# EasyEDA Pro project 25工创PCB.eprj, board 云台底部分线板PCB
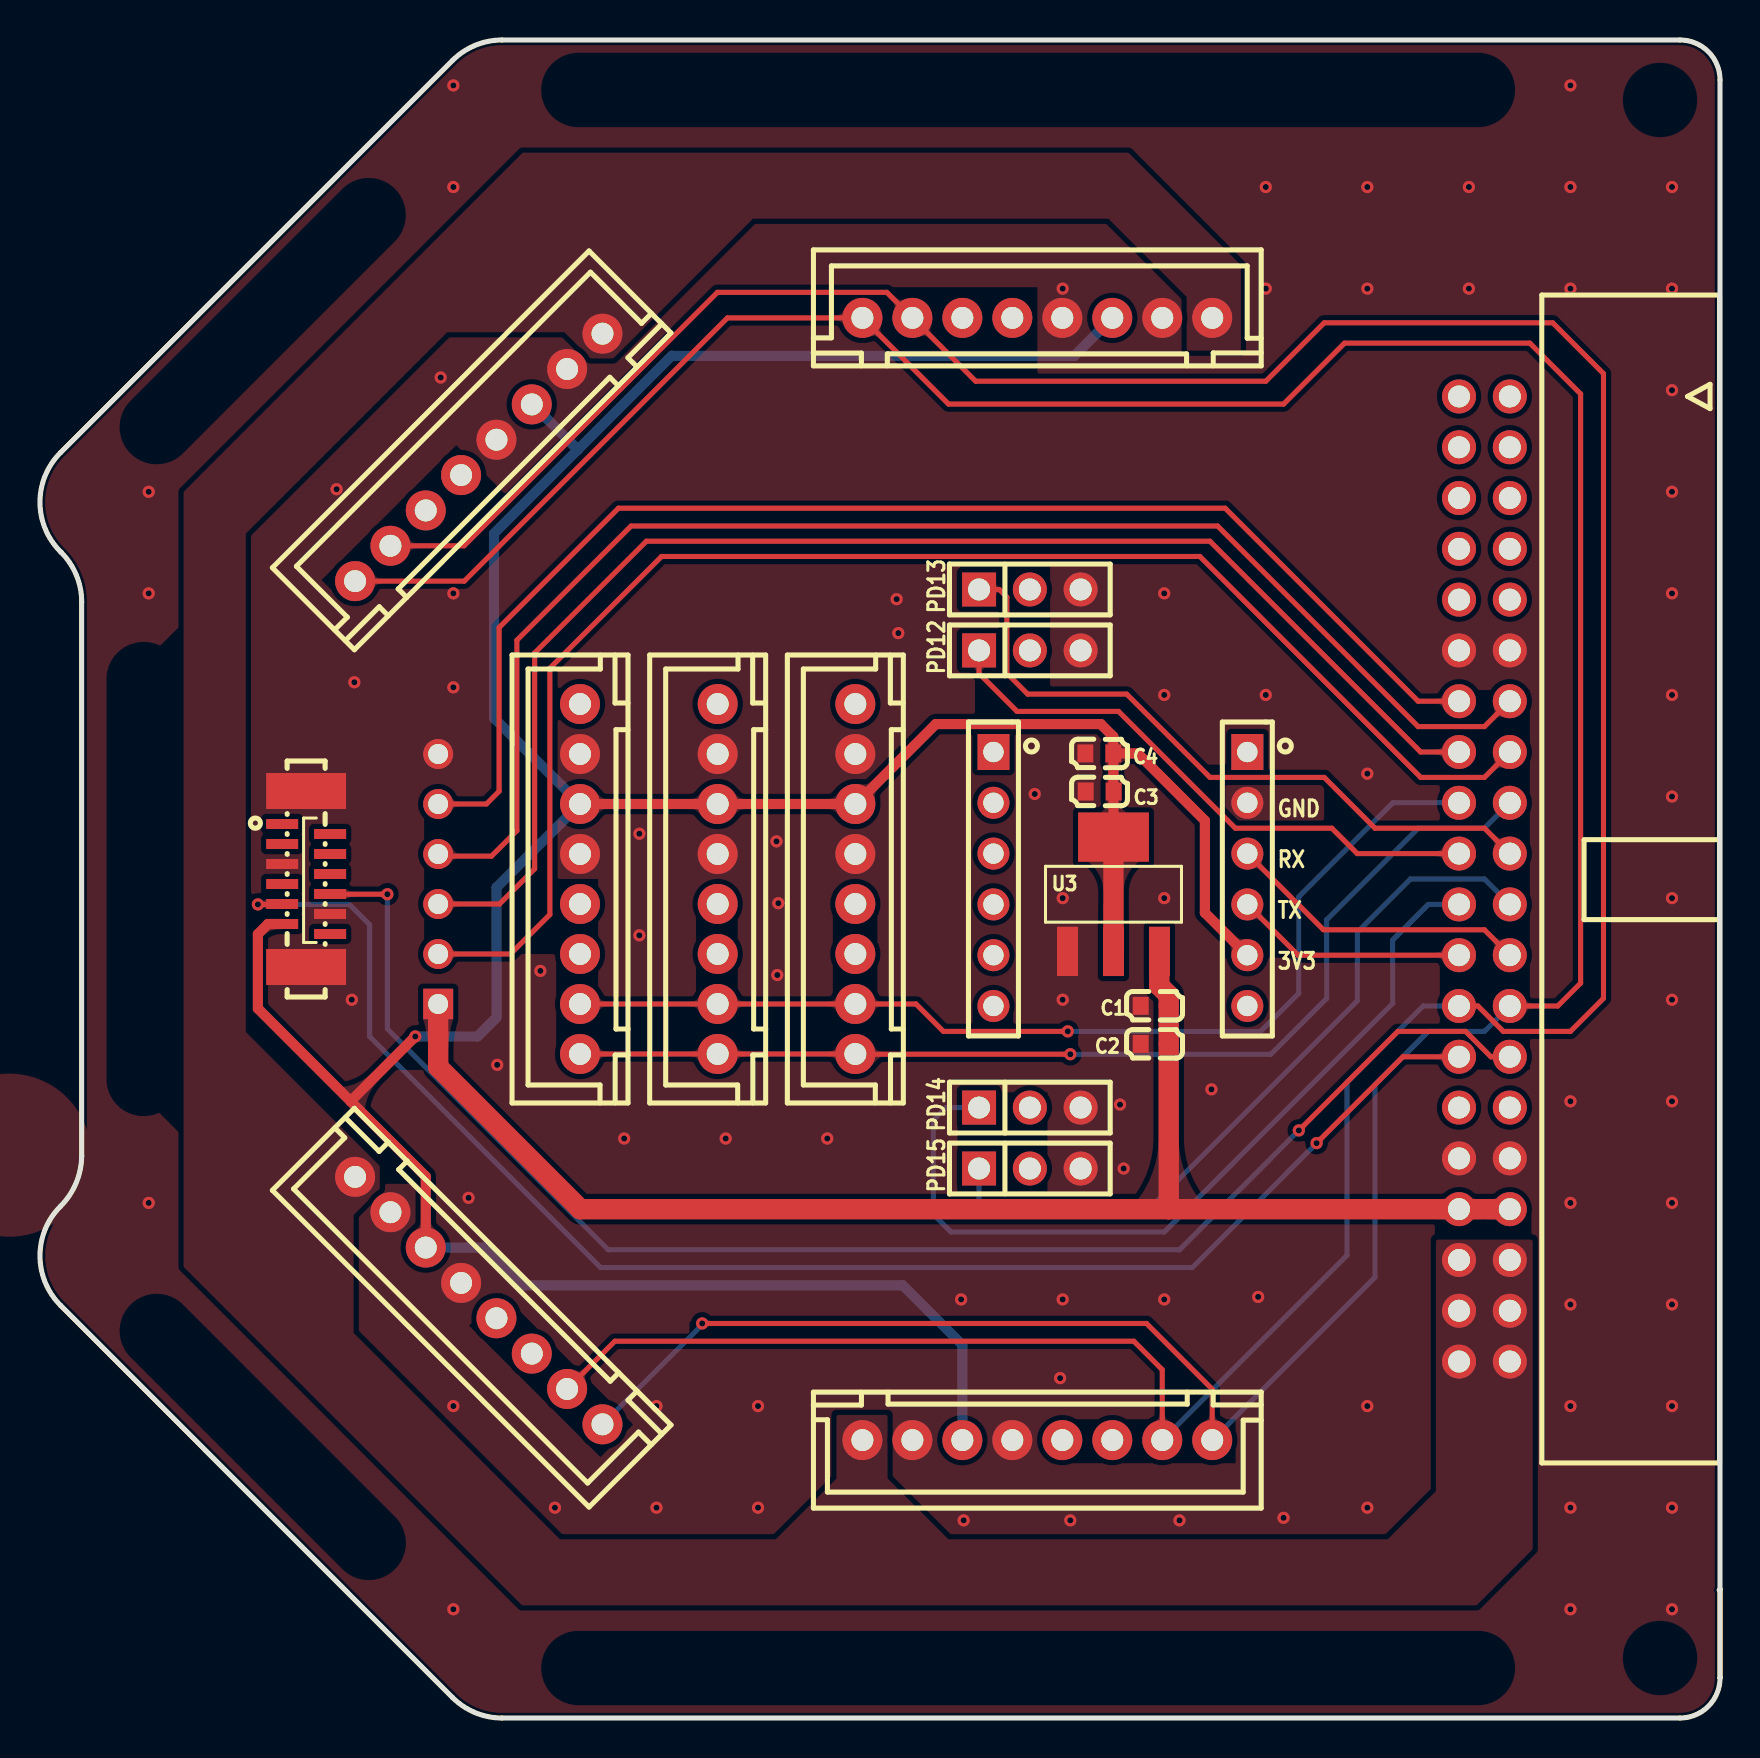
[diagram p12: board, top side]
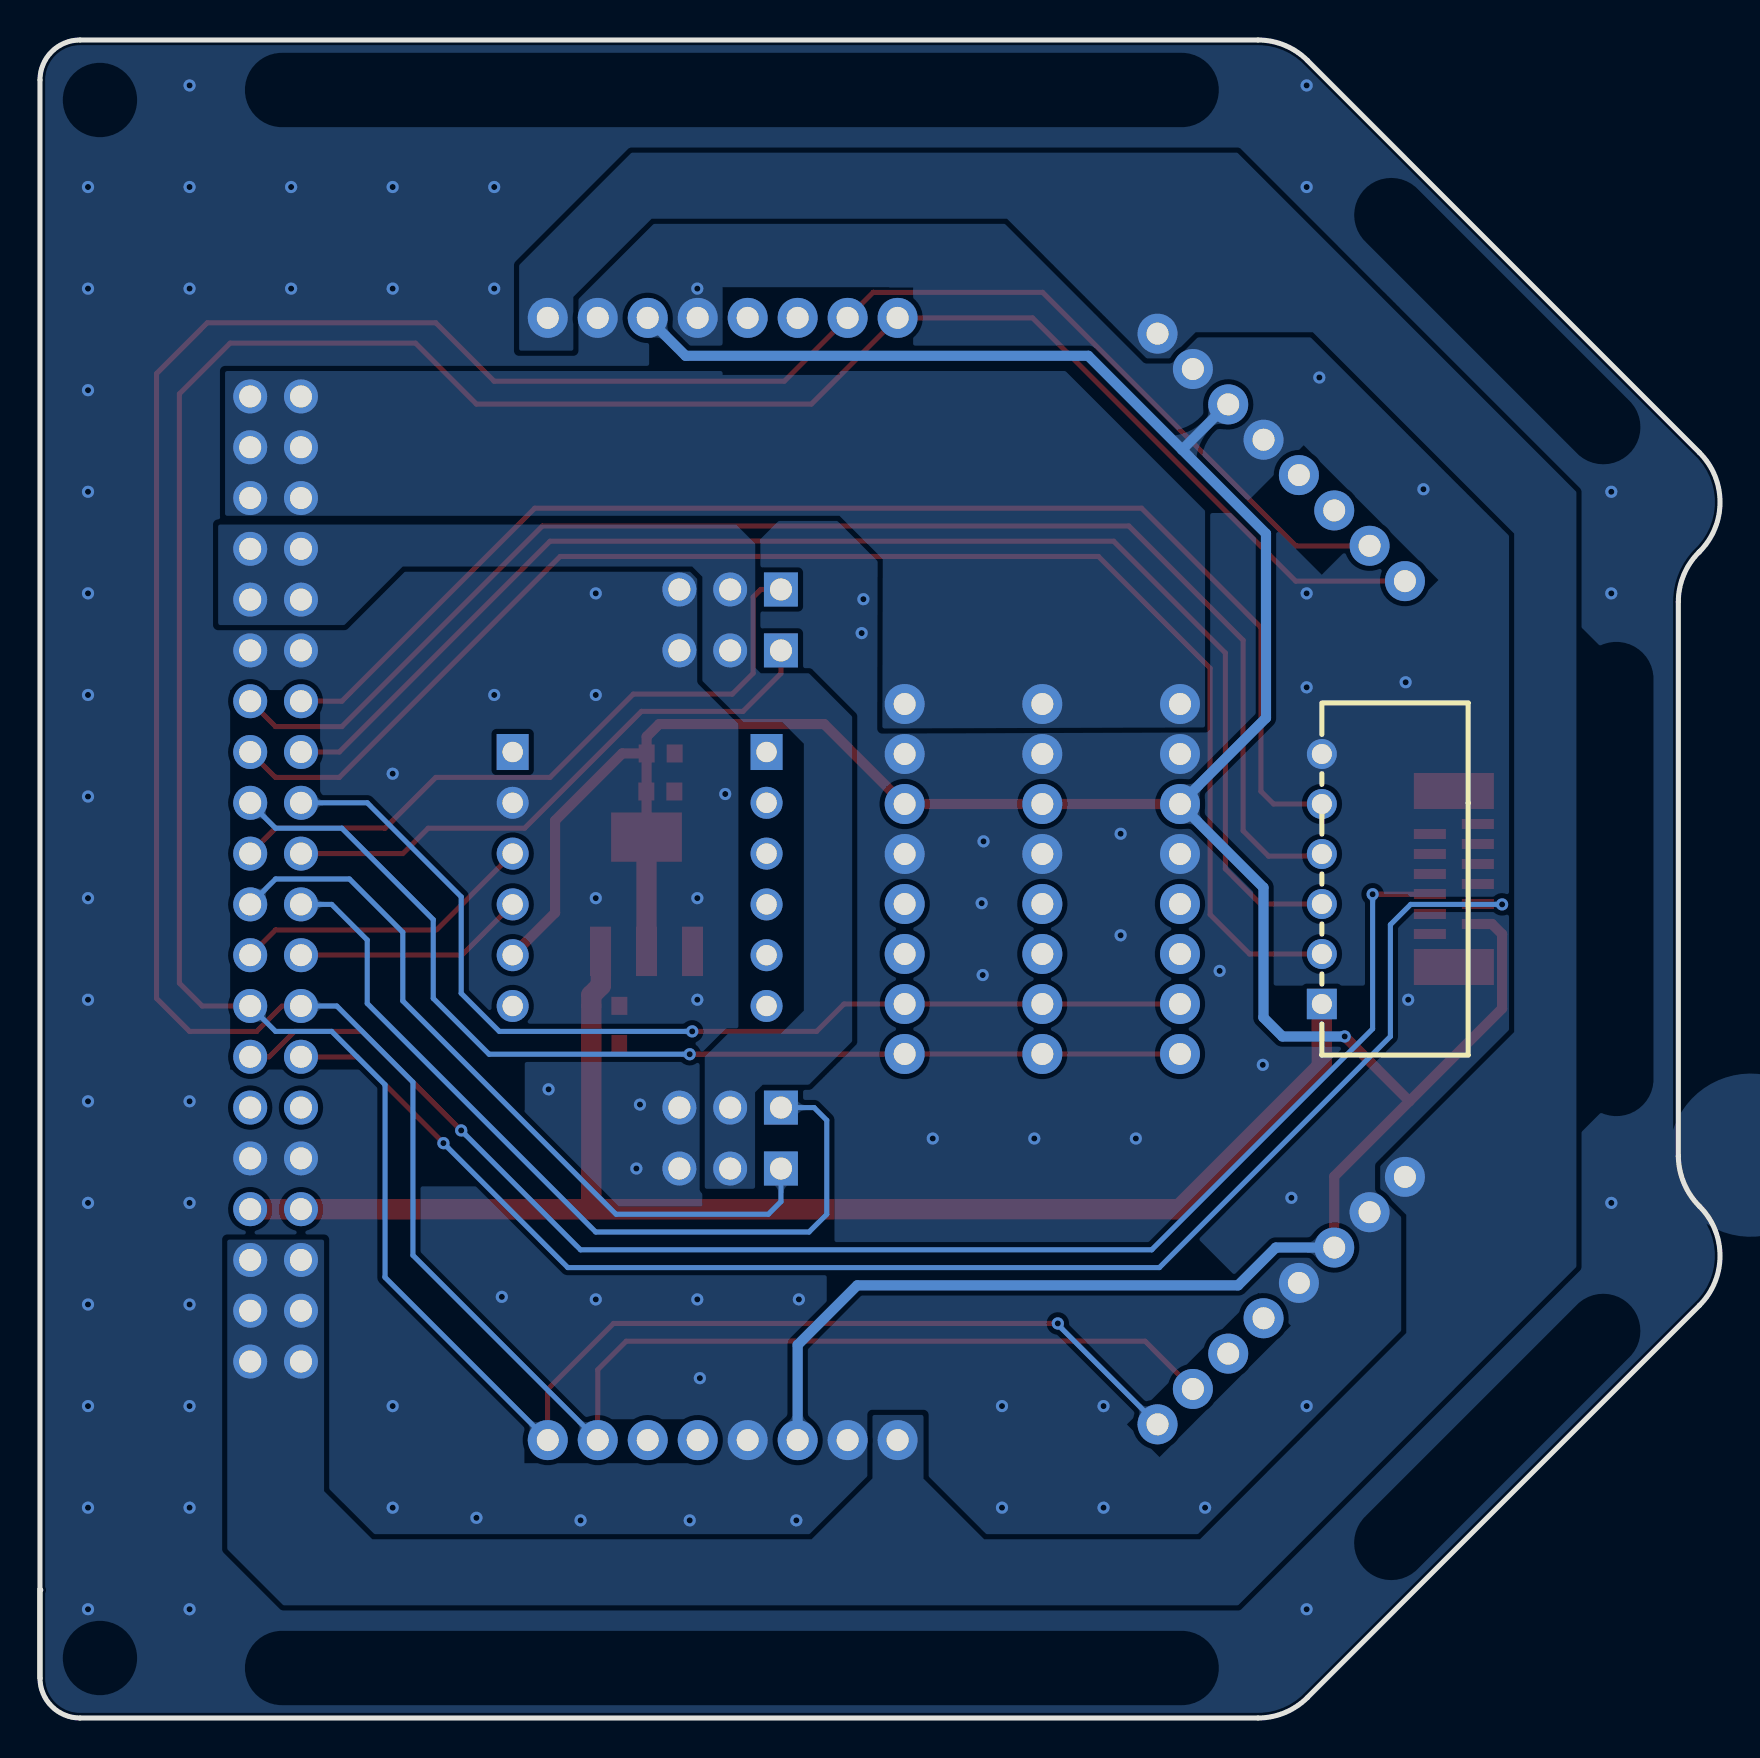
[diagram p13: board, bottom side, seen from below]

Outline 84.04 x 83.91 mm; copper layers: Top Layer, Bottom Layer. Coordinates in mm from the lower left corner of the outline.
Outline path: 1.03,25.59 arc(0,23.11) 1.03,20.64 20.64,1.03 arc(21.77,0.27) 23.11,0 82.04,0 arc(83.46,0.59) 84.04,2 ; 1.03,25.59 1.06,25.62 ; 1.03,25.59 arc(1.8,26.74) 2.09,28.1 2.09,55.81 arc(1.82,57.15) 1.06,58.29 1.03,58.32 arc(0,60.8) 1.03,63.27 20.64,82.89 arc(21.77,83.64) 23.11,83.91 82.04,83.91 arc(83.46,83.32) 84.04,81.91 84.04,2 ; 84.04,2 84.04,6.44 84,6.4
Stack: Top Layer 0.035mm / Dielectric1 1.51mm FR4 er 4.5 / Bottom Layer 0.035mm

## Design rules (mm)
template: 自定义配置
spacing copperThickness1oz (default): track to track 0.102, other pairs 0.152 to 0.3
spacing copperThickness2oz: track to track 0.203, other pairs 0.152 to 0.3
track width copperThickness1oz (default): min 0.127, default 0.254, max 2.54
track width copperThickness2oz: min 0.203, default 0.254, max 2.54
differential pair differentialPair (default): width min 0.127, default 0.254, max 2.54; gap min 0.152, default 0.152
via viaSize (default): diameter min 0.5, default 0.61, max 10; hole min 0.3, default 0.305, max 6.3

## Placement (name value [footprint] x y rotation side)
C1  100nF  [C0603]  55.76 35.61 0 top
C2  100nF  [C0603]  55.76 33.71 0 top
C3  100nF  [C0603]  53.01 46.33 0 top
C4  100nF  [C0603]  52.99 48.23 180 top
CN1  B-3000R40P-0110  [IDC-TH_40P-P2.54_300R-40P]  72.26 41.96 90 top
CN2  ZX-XH2.54-8PZZ  [CONN-TH_8P-P2.50-XH2.54-8P]  40.79 41.96 270 top
CN3  ZX-XH2.54-8PZZ  [CONN-TH_8P-P2.50-XH2.54-8P]  33.9 41.96 270 top
CN4  ZX-XH2.54-8PZZ  [CONN-TH_8P-P2.50-XH2.54-8P]  27.01 41.96 270 top
CN5  ZX-XH2.54-8PZZ  [CONN-TH_8P-P2.50-XH2.54-8P#2]  21.95 63.04 225 top
CN6  ZX-XH2.54-8PZZ  [CONN-TH_8P-P2.50-XH2.54-8P#2]  21.95 20.87 315 top
CN7  ZX-XH2.54-8PZZ  [CONN-TH_8P-P2.50-XH2.54-8P]  49.89 70.01 180 top
CN8  ZX-XH2.54-8PZZ  [CONN-TH_8P-P2.50-XH2.54-8P]  49.89 13.9 0 top
H1  -  [HDR-TH_3P-P2.54-V-M]  49.52 53.39 0 top
H2  -  [HDR-TH_3P-P2.54-V-M]  49.52 56.43 0 top
H3  -  [HDR-TH_3P-P2.54-V-M]  49.52 30.53 0 top
H4  -  [HDR-TH_3P-P2.54-V-M]  49.52 27.48 0 top
HWT1  PM2.54-1*6  [hdr-th_6p-p2.54-v-f]  60.4 41.96 270 top
U1  FPC-0.5AL-12PB  [FPC-SMD_12P-P0.50_XUNPU_FPC-0.5AL-12PB]  13.31 41.96 270 top
U2  ZX-XH2.54-6PWZ  [CONN-TH_6P-P2.50_ZX-XH2.54-6PWZ]  19.92 41.96 90 bottom
U3  AMS1117-3.3  [SOT-223_L6.5-W3.5-P2.30-LS7.0-BR]  53.7 41.19 270 top
U4  PM2.54-1*6  [hdr-th_6p-p2.54-v-f]  47.7 41.96 270 top

## Footprints (pads in the part's own frame, mm; a bottom-side part is the same pattern mirrored in y, then rotated)
C0603
  rect 0.8x0.9 smd: 1(-0.7,0) 2(0.7,0)
CONN-TH_6P-P2.50_ZX-XH2.54-6PWZ
  rect 1.524x1.5 hole 1: 1(-6.25,0)
  round 1.5 hole 1: 2(-3.75,0) 3(-1.25,0) 4(1.25,0) 5(3.75,0) 6(6.25,0)
CONN-TH_8P-P2.50-XH2.54-8P
  round 2 hole 1.1: 1(8.75,0) 2(6.25,0) 3(3.75,0) 4(1.25,0) 5(-1.25,0) 6(-3.75,0) 7(-6.25,0) 8(-8.75,0)
CONN-TH_8P-P2.50-XH2.54-8P#2
  round 2 hole 1.1: 1(8.75,0) 2(6.25,0) 3(3.75,0) 4(1.25,0) 5(-1.25,0) 6(-3.75,0) 7(-6.25,0) 8(-8.75,0)
FPC-SMD_12P-P0.50_XUNPU_FPC-0.5AL-12PB
  rect 0.5x1.6 smd: 1(-2.75,-1.2) 2(-2.25,1.2) 3(-1.75,-1.2) 4(-1.25,1.2) 5(-0.75,-1.2) 6(-0.25,1.2) 7(0.25,-1.2) 8(0.75,1.2) 9(1.25,-1.2) 10(1.75,1.2) 11(2.25,-1.2) 12(2.75,1.2)
  rect 1.8x4 smd: 13(4.4,0) 14(-4.4,0)
HDR-TH_3P-P2.54-V-M
  rect 1.7x1.7 hole 1.1: 1(-2.54,0)
  round 1.7 hole 1.1: 2(0,0) 3(2.54,0)
hdr-th_6p-p2.54-v-f
  rect 1.8x1.6 hole 1.02: 1(-6.35,0)
  round 1.6 hole 1.02: 2(-3.81,0) 3(-1.27,0) 4(1.27,0) 5(3.81,0) 6(6.35,0)
IDC-TH_40P-P2.54_300R-40P
  round 1.7 hole 1.1: 1(24.13,1.27) 2(24.13,-1.27) 3(21.59,1.27) 4(21.59,-1.27) 5(19.05,1.27) 6(19.05,-1.27) 7(16.51,1.27) 8(16.51,-1.27) 9(13.97,1.27) 10(13.97,-1.27) 11(11.43,1.27) 12(11.43,-1.27) 13(8.89,1.27) 14(8.89,-1.27) 15(6.35,1.27) 16(6.35,-1.27) 17(3.81,1.27) 18(3.81,-1.27) 19(1.27,1.27) 20(1.27,-1.27) 21(-1.27,1.27) 22(-1.27,-1.27) 23(-3.81,1.27) 24(-3.81,-1.27) 25(-6.35,1.27) 26(-6.35,-1.27) 27(-8.89,1.27) 28(-8.89,-1.27) 29(-11.43,1.27) 30(-11.43,-1.27) 31(-13.97,1.27) 32(-13.97,-1.27) 33(-16.51,1.27) 34(-16.51,-1.27) 35(-19.05,1.27) 36(-19.05,-1.27) 37(-21.59,1.27) 38(-21.59,-1.27) 39(-24.13,1.27) 40(-24.13,-1.27)
SOT-223_L6.5-W3.5-P2.30-LS7.0-BR
  rect 2.465x1.05 smd: 1(2.857,-2.3) 2(2.857,0) 3(2.857,2.3)
  rect 2.465x3.54 smd: 4(-2.857,0)

## Nets
As in the schematic.

Pads without a net: CN2 3 4; CN3 3 4; CN4 3 4; CN5 3 4; CN6 3 4; CN7 3 4; CN8 3 4; HWT1 1 6; U1 1 2 3 4 6 7 12; U4 1 2 3 4 5 6

## Via types
v1: diameter 0.61, hole 0.305, Top Layer to Bottom Layer, 92 vias

## Routing (per net, layer and track width the routed paths; a pad name or vN(x,y) marks a point on that pad's centre or on a via; arc(x,y) is an arc through that point)
+3V3: length 182.5
  Top Layer w0.508: C4.1 54.91,48.23 58.27,44.88 58.27,40.27 HWT1.5 ; C4.1 53.69,49.07 53.06,49.7 44.81,49.7 40.81,45.71 CN2.6 CN3.6 CN4.6 ; C4.1 53.69,46.34 53.7,46.34 U3.4 ; CN6.6 19.3,27.08 15.54,30.84 ; v1(18.77,34.08) 15.54,30.84 ; 15.54,30.84 10.9,35.48 10.9,39.2 11.41,39.71 U1.11
  Top Layer w1.016: U3.2 U3.4
  Bottom Layer w0.508: v1(18.77,34.08) 21.89,34.08 22.84,35.03 22.84,41.53 CN4.6 22.71,50.01 22.71,59.23 26.91,63.42 ; 26.91,63.42 24.64,65.69 CN5.6 ; 26.91,63.42 31.6,68.12 51.74,68.12 CN7.6 ; CN8.6 46.14,18.65 43.16,21.64 24.11,21.64 22.22,23.52 CN6.6
+5V: length 72.8
  Top Layer w1.016: 56.46,25.45 27.03,25.45 19.92,32.56 U2.1 ; 56.46,25.45 CN1.33 CN1.34 ; 56.46,25.45 C2.2 C1.2 56.46,36.15 55.99,36.62 55.99,38.32 U3.3
GND:
  vias: v1(5.44,61.32) v1(5.44,56.24) v1(5.44,25.76) v1(14.84,61.45) v1(15.6,35.92) v1(15.73,51.79) v1(20.04,67.03) v1(20.68,81.64) v1(20.68,76.56) v1(20.68,56.24) v1(20.68,51.54) v1(20.68,15.6) v1(20.68,5.44) v1(21.44,26.01) v1(22.87,32.66) v1(25.03,37.36) v1(25.76,10.52) v1(29.22,28.98) v1(29.98,44.22) v1(29.98,39.14) v1(30.84,15.6) v1(30.84,10.52) v1(34.3,28.98) v1(35.92,15.6) v1(35.92,10.52) v1(36.84,43.84) v1(36.93,40.74) v1(36.88,37.15) v1(39.38,28.98) v1(42.85,55.95) v1(42.94,54.25) v1(46.08,20.93) v1(46.21,9.88) v1(49.76,46.21) v1(51.03,17) v1(51.16,71.48) v1(51.16,41) v1(51.16,35.92) v1(51.16,20.93) v1(51.54,9.88) v1(54.03,30.68) v1(54.21,27.48) v1(56.24,56.24) v1(56.24,51.16) v1(56.24,41) v1(56.24,20.93) v1(57,9.88) v1(58.6,31.44) v1(60.94,21.06) v1(61.32,76.56) v1(61.32,71.48) v1(61.32,51.16) v1(62.21,10.01) v1(66.4,76.56) v1(66.4,71.48) v1(66.4,47.22) v1(66.4,15.6) v1(66.4,10.52) v1(71.48,76.56) v1(71.48,71.48) v1(76.56,81.64) v1(76.56,76.56) v1(76.56,71.48) v1(76.56,30.84) v1(76.56,25.76) v1(76.56,20.68) v1(76.56,15.6) v1(76.56,10.52) v1(76.56,5.44) v1(81.64,76.56) v1(81.64,71.48) v1(81.64,66.4) v1(81.64,61.32) v1(81.64,56.24) v1(81.64,51.16) v1(81.64,46.08) v1(81.64,41) v1(81.64,35.92) v1(81.64,30.84) v1(81.64,25.76) v1(81.64,20.68) v1(81.64,15.6) v1(81.64,10.52) v1(81.64,5.44)
PB12: length 66
  Top Layer w0.254: U2.5 22.33,45.71 22.97,46.34 22.97,54.53 28.93,60.5 59.29,60.5 68.94,50.85 CN1.13
PB13: length 70.8
  Top Layer w0.254: CN1.14 72.26,49.58 68.94,49.58 58.91,59.61 29.57,59.61 23.85,53.89 23.85,44.37 22.58,43.1 20.02,43.1 U2.4
PB14: length 69.3
  Top Layer w0.254: U2.3 22.99,40.71 24.74,42.46 24.74,53.26 30.33,58.85 58.53,58.85 69.07,48.31 CN1.15
PB15: length 74.2
  Top Layer w0.254: U2.2 23.53,38.21 25.51,40.18 25.51,52.5 31.09,58.08 58.02,58.08 69.07,47.04 72.26,47.04 CN1.16
SERVO_PWM1: length 28.9
  Top Layer w0.254: CN1.19 65.89,43.23 64.62,44.5 59.8,44.5 53.95,50.34 48.87,50.34 46.98,52.24 H1.1
SERVO_PWM2: length 34.3
  Top Layer w0.254: H2.1 47.98,56.43 48.37,56.05 48.37,52.24 49.41,51.2 54.36,51.2 58.53,47.04 64.24,47.04 66.78,44.5 72.26,44.5 CN1.20
SERVO_PWM3: length 42.6
  Bottom Layer w0.254: CN1.21 69.45,40.69 67.67,38.91 67.67,35.73 56.24,24.3 45.57,24.3 44.68,25.19 44.68,29.89 45.32,30.53 H3.1
SERVO_PWM4: length 37.9
  Bottom Layer w0.254: CN1.22 72.26,41.96 68.56,41.96 65.89,39.29 65.89,35.86 55.22,25.19 47.6,25.19 46.98,25.82 H4.1
UART4_RX: length 170.4
  Top Layer w0.254: CN1.26 75.92,35.61 77.07,36.75 77.07,66.21 74.53,68.75 65.26,68.75 62.21,65.7 45.45,65.7 CN7.1 34.39,70.01 21.22,56.85 15.76,56.85 ; v1(33.13,19.73) 55.35,19.73 58.64,16.44 CN8.1
  Bottom Layer w0.254: CN8.1 66.78,22.04 66.78,31.67 69.45,34.34 72.26,34.34 CN1.26 ; 28.14,14.69 33.13,19.67 v1(33.13,19.73)
UART4_TX: length 173.5
  Top Layer w0.254: CN5.2 21.21,58.62 33.89,71.29 42.36,71.29 CN7.2 46.81,66.85 61.32,66.85 64.24,69.77 75.67,69.77 78.21,67.23 78.21,35.99 76.56,34.34 73.2,34.34 71.93,35.61 CN1.25 ; CN8.2 56.14,17.42 54.72,18.84 28.76,18.84 CN6.2
  Bottom Layer w0.254: CN8.2 65.38,23.14 65.38,31.8 69.19,35.61 CN1.25
UART5_RX: length 75.4
  Top Layer w0.254: U1.8 14.53,41.19 v1(17.38,41.19) ; CN1.28 72.58,33.07 71.31,34.34 67.92,34.34 v1(62.97,29.38)
  Bottom Layer w0.254: v1(17.38,41.19) 17.38,34.46 28.43,23.41 57,23.41 v1(62.97,29.38)
UART5_TX: length 76.5
  Top Layer w0.254: v1(10.9,40.69) 12.09,40.69 U1.9 ; v1(63.86,28.75) 68.18,33.07 CN1.27
  Bottom Layer w0.254: v1(10.9,40.69) 15.47,40.69 16.49,39.67 16.49,34.08 28.05,22.52 57.64,22.52 v1(63.86,28.75)
USART3_RX: length 54
  Top Layer w0.254: v1(51.54,33.19) 40.8,33.19 CN2.1 CN3.1 CN4.1
  Bottom Layer w0.254: CN1.18 72.26,44.5 68.94,44.5 64.37,39.92 64.37,35.99 61.57,33.19 v1(51.54,33.19)
USART3_TX: length 52.1
  Top Layer w0.254: CN4.2 CN3.2 CN2.2 43.82,35.71 45.19,34.34 v1(51.41,34.34)
  Bottom Layer w0.254: v1(51.41,34.34) 61.07,34.34 62.97,36.24 62.97,41.07 67.67,45.77 CN1.17
USART6_RX: length 15.2
  Top Layer w0.254: HWT1.3 64.21,39.42 72.26,39.42 CN1.24
USART6_TX: length 11.6
  Top Layer w0.254: HWT1.4 62.94,38.15 CN1.23

## Copper pours and planes (outline as drawn; the poured copper is in the pictures)
24V_1 on Top Layer: 15.69,25.16 15.69,19.26 26.01,8.94 36.81,8.94 39.85,11.97 39.85,15.16 42.4,15.16 42.4,11.98 45.44,8.94 67.42,8.94 69.83,11.35 69.83,23.92 74.67,23.92 74.67,8.45 71.86,5.63 24.11,5.63 7.18,22.56 7.18,61.32 24.14,78.28 54.45,78.28 60.07,72.65 60.07,68.38 57.36,68.38 57.36,71.06 53.45,74.98 35.67,74.98 28.68,67.99 27.54,67.99 26.23,69.29 20.37,69.29 10.3,59.23 10.3,34.3 17,27.6 17,26.46
24V_1 on Bottom Layer: 15.69,25.16 15.69,19.26 26.01,8.94 36.81,8.94 39.85,11.97 39.85,15.16 42.4,15.16 42.4,11.98 45.44,8.94 67.42,8.94 69.83,11.35 69.83,23.92 74.67,23.92 74.67,8.45 71.86,5.63 24.11,5.63 7.18,22.56 7.18,61.32 24.14,78.28 54.45,78.28 60.07,72.65 60.07,68.38 57.36,68.38 57.36,71.06 53.45,74.98 35.67,74.98 28.68,67.99 27.54,67.99 26.23,69.29 20.37,69.29 10.3,59.23 10.3,34.3 17,27.6 17,26.46
24V_2 on Bottom Layer: 74.78,67.36 32.74,67.36 25.76,60.37 25.76,49.54 41.9,49.49 41.88,57.95 44.05,60.12 74.78,60.12
+6V on Bottom Layer: 75.13,59.68 49.22,59.68 48.26,58.72 48.26,52.52 47.98,52.24 45.57,52.24 43.41,50.08 43.41,33.83 45.57,31.67 47.89,31.67 48.27,31.29 48.27,26.46 50.79,26.46 50.79,33.06 49.61,34.23 46.97,34.23 45.83,35.37 45.83,48.72 46.91,49.81 48.85,49.81 50.91,51.86 50.91,57.07 51.41,57.58 65.89,57.58 68.81,54.66 75.13,54.66
GND on Top Layer: -6.24,88.44 90.4,88.44 90.4,-3.51 -6.24,-3.51
GND on Bottom Layer: -3.7,86.66 88.12,86.66 88.12,-2.62 -3.7,-2.62

Small or netless copper shapes (teardrops, artwork), in the pictures only: 72 on Top Layer, 26 on Bottom Layer

## Text on the board
Top Silkscreen Layer: GND | RX | TX | 3V3 | PD13 | PD12 | PD14 | PD15
